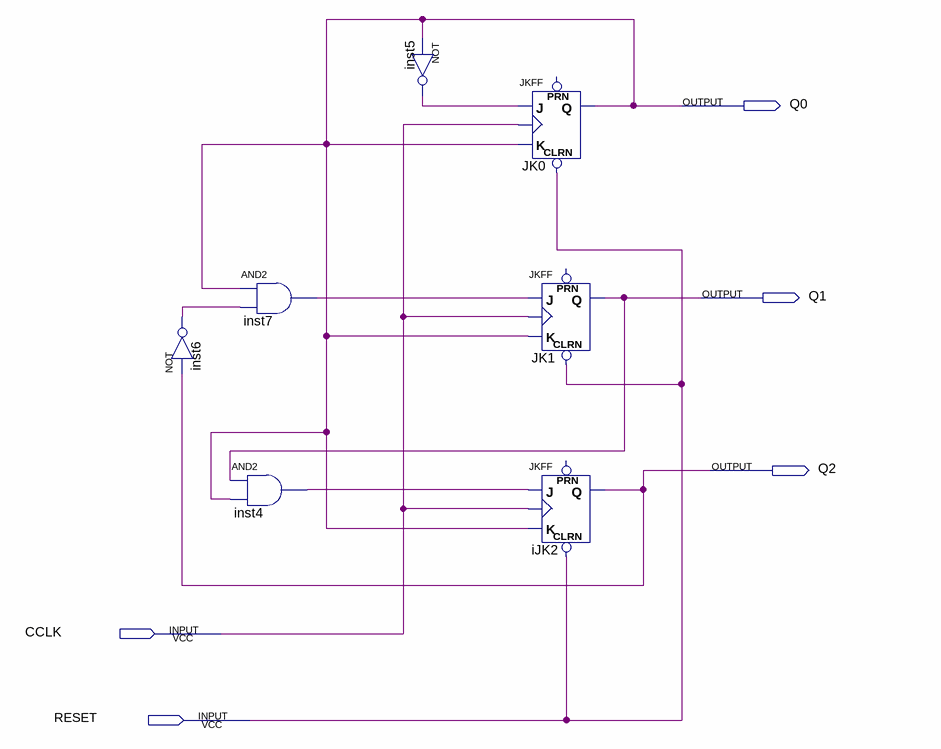
[diagram p0: schematic sheet]
// Quartus schematic lab_2ANoClk.bdf as structural Verilog: 7 symbols, 5 pins
module lab_2ANoClk (
  input  CCLK,
  input  RESET,
  output Q0,
  output Q1,
  output Q2
);

  wire inst4_out, inst5_out, inst6_out, inst7_out;

  not inst6 (inst6_out, Q2);
  and inst7 (inst7_out, Q0, inst6_out);
  and inst4 (inst4_out, Q1, Q0);
  not inst5 (inst5_out, Q0);
  JKFF JK0 (.CLRN(RESET), .K(Q0), .J(inst5_out), .CLK(CCLK), .Q(Q0));  // open: PRN
  JKFF JK1 (.CLRN(RESET), .K(Q0), .J(inst7_out), .CLK(CCLK), .Q(Q1));  // open: PRN
  JKFF iJK2 (.CLRN(RESET), .K(Q0), .J(inst4_out), .CLK(CCLK), .Q(Q2));  // open: PRN
endmodule
